# Altium schematic sheet 气象传感器.SchDoc
size A2; Organization: Altium Limited; Address1: L3, 12a Rodborough Rd; Address2: Frenchs Forest; Address3: NSW; Address4: Australia 2086
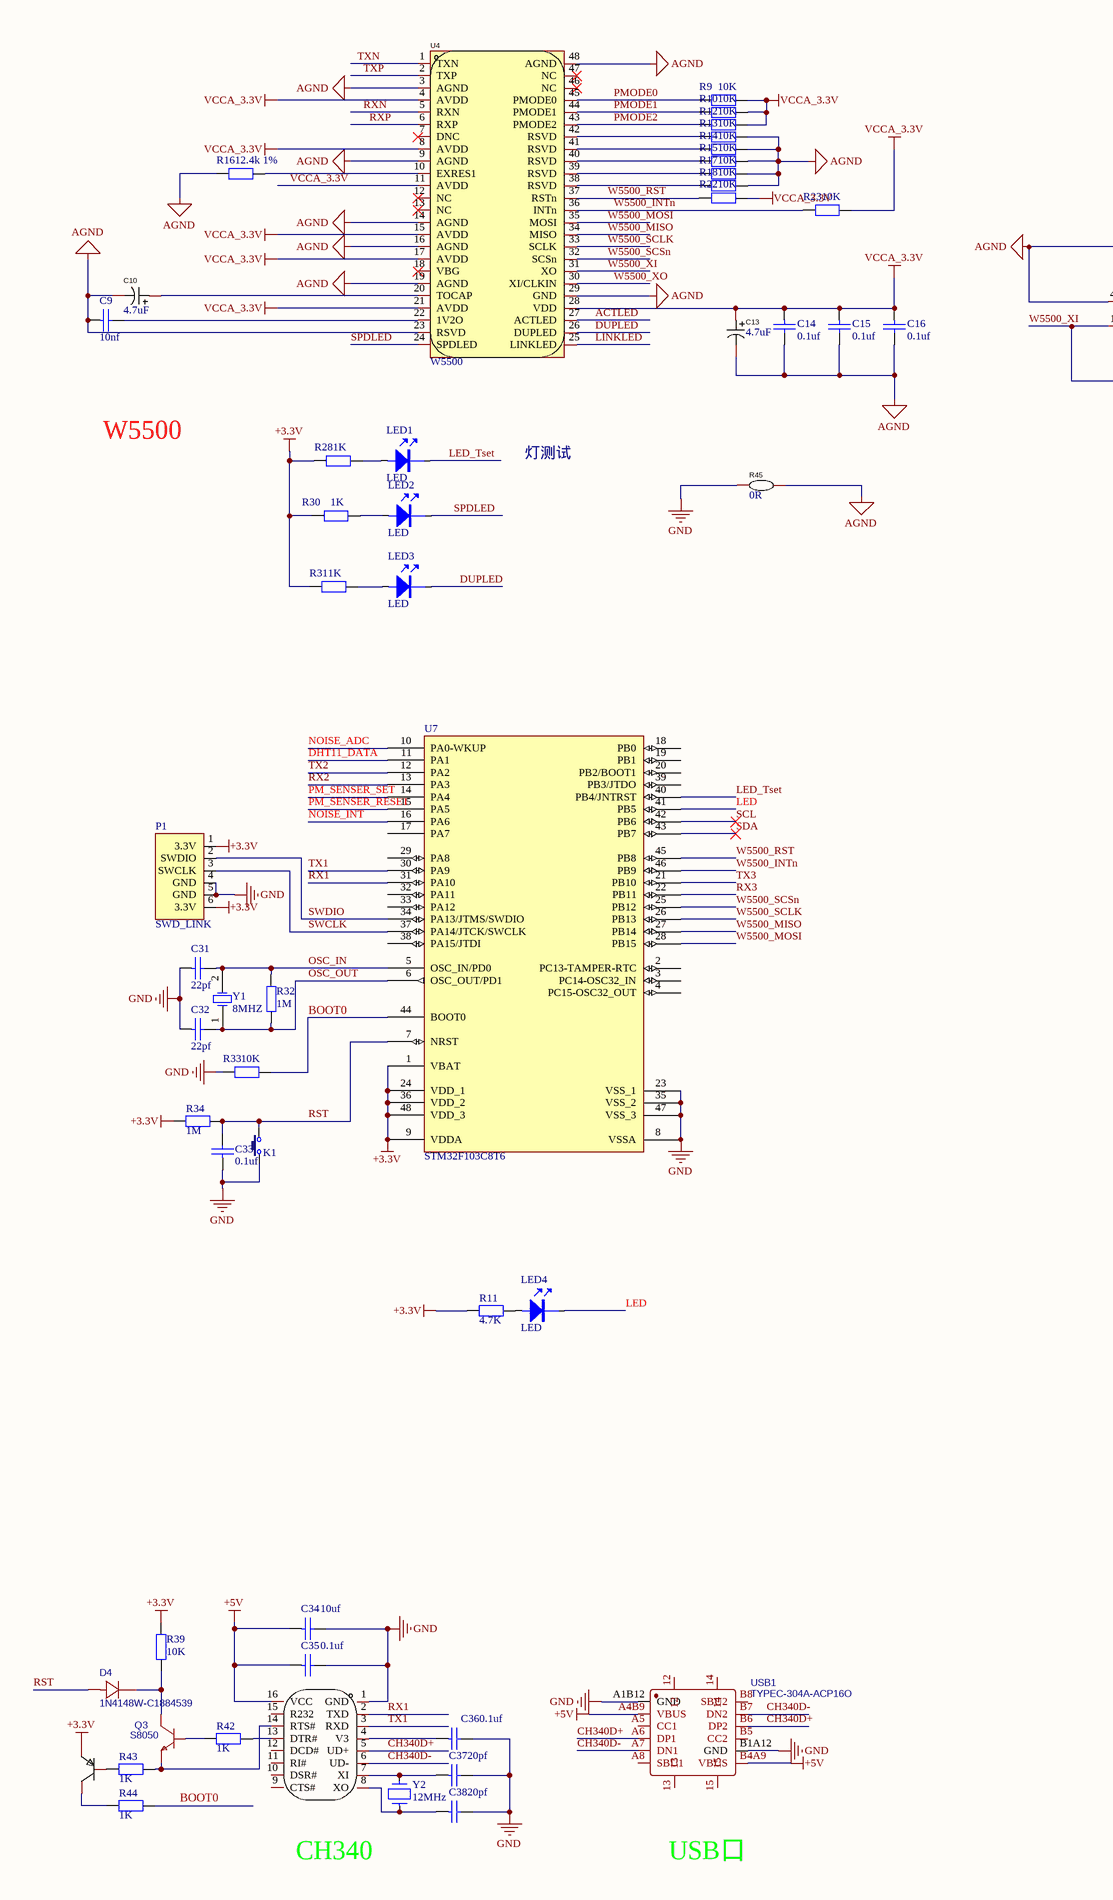
[diagram p0: 气象传感器.SchDoc, left]
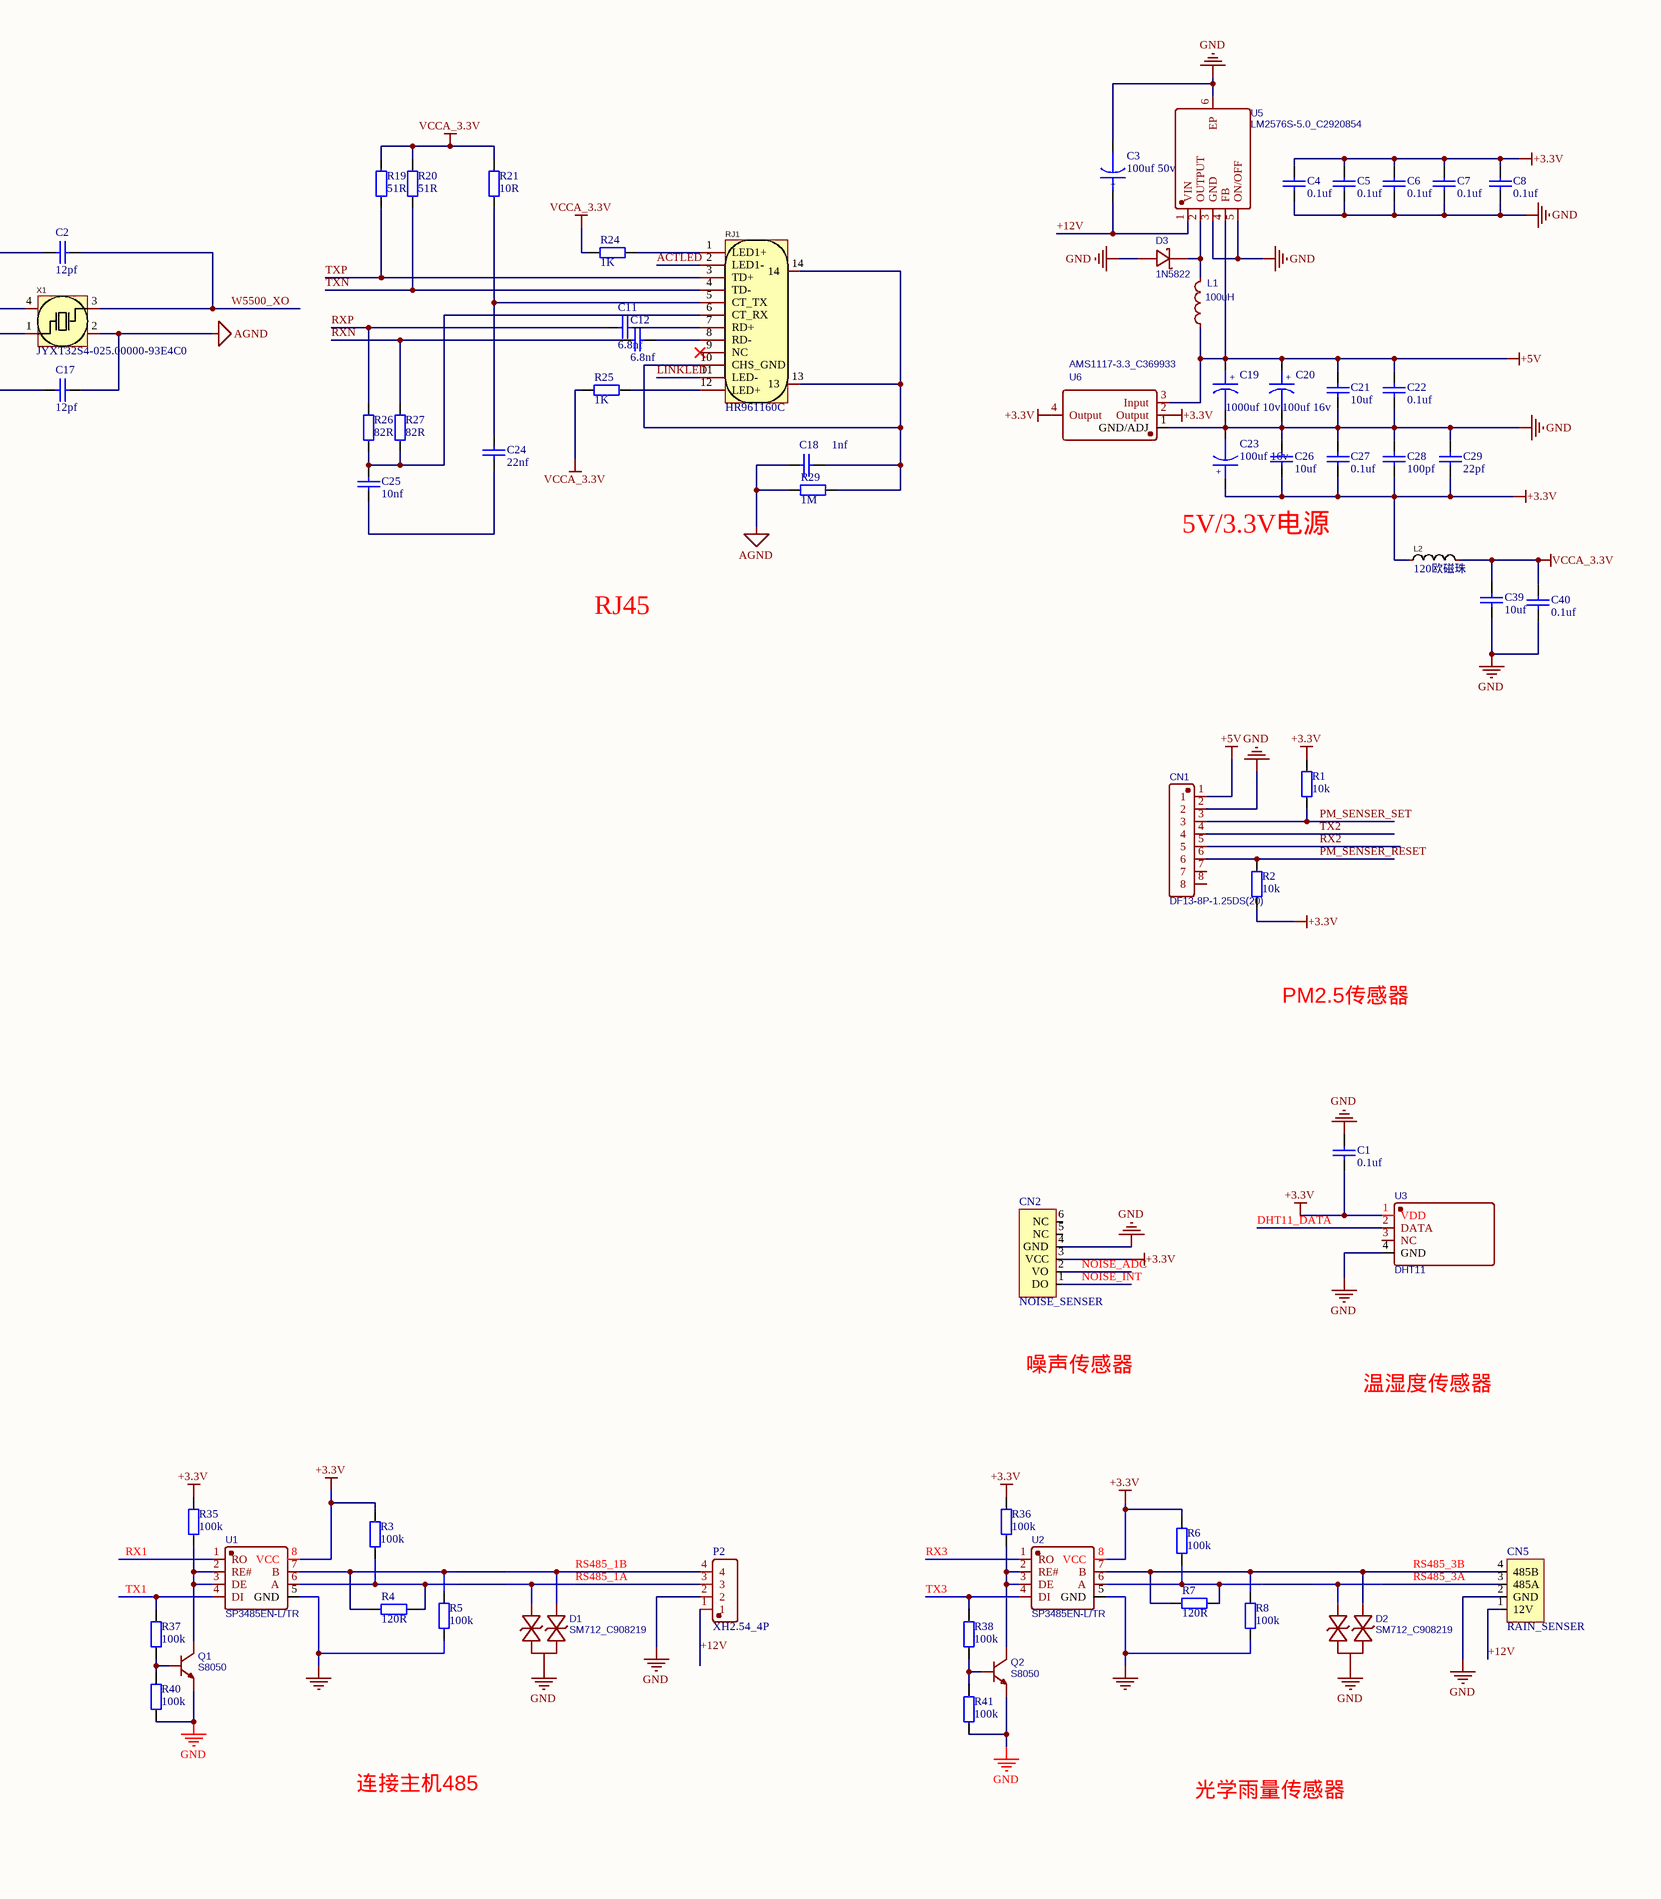
[diagram p1: 气象传感器.SchDoc, right]

## Parts
C1  value 0.1uf  [0603C]  (hidden comment: Capacitor)
C2  value 12pf  [0603C]  (hidden comment: Capacitor)
C3  value 100uf 50v  [CAP-TH_BD8.0-P3.50-D0.6-FD]  (hidden comment: Capacitor)
C4  value 0.1uf  [0603C]  (hidden comment: Capacitor)
C5  value 0.1uf  [0603C]  (hidden comment: Capacitor)
C6  value 0.1uf  [0603C]  (hidden comment: Capacitor)
C7  value 0.1uf  [0603C]  (hidden comment: Capacitor)
C8  value 0.1uf  [0603C]  (hidden comment: Capacitor)
C9  value 10nf  [0603C]  (hidden comment: Capacitor)
C10  4.7uF  [CAP-SMD_L1.6-W0.9-FD]
C11  value 6.8nf  [0603C]  (hidden comment: Capacitor)
C12  value 6.8nf  [0603C]  (hidden comment: Capacitor)
C13  4.7uF  [CAP-SMD_L1.6-W0.9-FD]
C14  value 0.1uf  [0603C]  (hidden comment: Capacitor)
C15  value 0.1uf  [0603C]  (hidden comment: Capacitor)
C16  value 0.1uf  [0603C]  (hidden comment: Capacitor)
C17  value 12pf  [0603C]  (hidden comment: Capacitor)
C18  value 1nf  [0603C]  (hidden comment: Capacitor)
C19  value 1000uf 10v  [CAP-TH_BD8.0-P3.50-D0.6-FD]  (hidden comment: Capacitor)
C20  value 100uf 16v  [CAP-TH_BD5.0-P2.00-D0.8-FD]  (hidden comment: Capacitor)
C21  value 10uf  [0805C]  (hidden comment: Capacitor)
C22  value 0.1uf  [0603C]  (hidden comment: Capacitor)
C23  value 100uf 16v  [CAP-TH_BD5.0-P2.00-D0.8-FD]  (hidden comment: Capacitor)
C24  value 22nf  [0603C]  (hidden comment: Capacitor)
C25  value 10nf  [0603C]  (hidden comment: Capacitor)
C26  value 10uf  [0805C]  (hidden comment: Capacitor)
C27  value 0.1uf  [0603C]  (hidden comment: Capacitor)
C28  value 100pf  [0603C]  (hidden comment: Capacitor)
C29  value 22pf  [0603C]  (hidden comment: Capacitor)
C31  value 22pf  [0603C]  (hidden comment: Capacitor)
C32  value 22pf  [0603C]  (hidden comment: Capacitor)
C33  value 0.1uf  [0603C]  (hidden comment: Capacitor)
C34  value 10uf  [0805C]  (hidden comment: Capacitor)
C35  value 0.1uf  [0603C]  (hidden comment: Capacitor)
C36  value 0.1uf  [0603C]  (hidden comment: Capacitor)
C37  value 20pf  [0603C]  (hidden comment: Capacitor)
C38  value 20pf  [0603C]  (hidden comment: Capacitor)
C39  value 10uf  [0805C]  (hidden comment: Capacitor)
C40  value 0.1uf  [0603C]  (hidden comment: Capacitor)
CN1  DF13-8P-1.25DS(20)  [CONN-TH_8P-P1.25_DF13-8P-1.25DS-20]
CN2  NOISE_SENSER  [NOISE_SENSER]
CN5  RAIN_SENSER  [RAIN_SENSER]
D1  SM712_C908219  [SOT-23-3_L2.9-W1.3-P1.90-LS2.4-BR]
D2  SM712_C908219  [SOT-23-3_L2.9-W1.3-P1.90-LS2.4-BR]
D3  1N5822  [SMA_L4.4-W2.8-LS5.4-RD]
D4  1N4148W-C1884539  [SOD-123_4148]
K1  3x6x5  [TSW SMD-3*6*2.5]  (value not drawn)
L1  100uH  [IND-TH_BD10.0-P5.00-D0.7]
L2  120欧磁珠  [L0603]
LED1  LED  [0603-LED]
LED2  LED  [0603-LED]
LED3  LED  [0603-LED]
LED4  LED  [0603-LED]
P1  SWD_LINK  [SWD_LINK]
P2  XH2.54_4P  [5.08 LINKER 1*4]
Q1  S8050  [SOT-23]
Q2  S8050  [SOT-23]
Q3  S8050  [SOT-23]
Q4  S8550  [SOT-23-3_L2.9-W1.3-P1.90-LS2.4-BR]  (value not drawn)
R1  value 10k  [0603R]  (hidden comment: Resistor)
R2  value 10k  [0603R]  (hidden comment: Resistor)
R3  value 100k  [0603R]  (hidden comment: Resistor)
R4  value 120R  [0603R]  (hidden comment: Resistor)
R5  value 100k  [0603R]  (hidden comment: Resistor)
R6  value 100k  [0603R]  (hidden comment: Resistor)
R7  value 120R  [0603R]  (hidden comment: Resistor)
R8  value 100k  [0603R]  (hidden comment: Resistor)
R9  value 10K  [0603R]  (hidden comment: Resistor)
R10  value 10K  [0603R]  (hidden comment: Resistor)
R11  value 4.7K  [0603R]  (hidden comment: Resistor)
R12  value 10K  [0603R]  (hidden comment: Resistor)
R13  value 10K  [0603R]  (hidden comment: Resistor)
R14  value 10K  [0603R]  (hidden comment: Resistor)
R15  value 10K  [0603R]  (hidden comment: Resistor)
R16  value 12.4k 1%  [0603R]  (hidden comment: Resistor)
R17  value 10K  [0603R]  (hidden comment: Resistor)
R18  value 10K  [0603R]  (hidden comment: Resistor)
R19  value 51R  [0603R]  (hidden comment: Resistor)
R20  value 51R  [0603R]  (hidden comment: Resistor)
R21  value 10R  [0603R]  (hidden comment: Resistor)
R22  value 10K  [0603R]  (hidden comment: Resistor)
R23  value 10K  [0603R]  (hidden comment: Resistor)
R24  value 1K  [0603R]  (hidden comment: Resistor)
R25  value 1K  [0603R]  (hidden comment: Resistor)
R26  value 82R  [0603R]  (hidden comment: Resistor)
R27  value 82R  [0603R]  (hidden comment: Resistor)
R28  value 1K  [0603R]  (hidden comment: Resistor)
R29  value 1M  [0603R]  (hidden comment: Resistor)
R30  value 1K  [0603R]  (hidden comment: Resistor)
R31  value 1K  [0603R]  (hidden comment: Resistor)
R32  value 1M  [0603R]  (hidden comment: Resistor)
R33  value 10K  [0603R]  (hidden comment: Resistor)
R34  value 1M  [0603R]  (hidden comment: Resistor)
R35  value 100k  [0603R]  (hidden comment: Resistor)
R36  value 100k  [0603R]  (hidden comment: Resistor)
R37  value 100k  [0603R]  (hidden comment: Resistor)
R38  value 100k  [0603R]  (hidden comment: Resistor)
R39  value 10K  [0603R]  (hidden comment: Resistor)
R40  value 100k  [0603R]  (hidden comment: Resistor)
R41  value 100k  [0603R]  (hidden comment: Resistor)
R42  value 1K  [0603R]  (hidden comment: Resistor)
R43  value 1K  [0603R]  (hidden comment: Resistor)
R44  value 1K  [0603R]  (hidden comment: Resistor)
R45  0R  [R0603]
RJ1  HR961160C  [RJ45-SMD_HR961160C]
U1  SP3485EN-L/TR  [SOIC-8_L5.0-W4.0-P1.27-LS6.0-BL]
U2  SP3485EN-L/TR  [SOIC-8_L5.0-W4.0-P1.27-LS6.0-BL]
U3  DHT11  [DHT11]
U4  W5500  [LQFP-48_L7.0-W7.0-P0.50-LS9.0-BL]
U5  LM2576S-5.0_C2920854  [TO-263-5_L10.2-W8.6-P1.70-LS14.4-TL]
U6  AMS1117-3.3_C369933  [SOT-223-4_L6.5-W3.5-P2.30-LS7.0-BR]
U7  STM32F103C8T6  [LQFP48 7X7_M]
U8  CH340G  [SOIC-16_L9.9-W3.9-P1.27-LS6.0-BL]  (value not drawn)
USB1  TYPEC-304A-ACP16O  [USB-SMD_TYPEC-304A-ACP16O]
X1  JYXT32S4-025.00000-93E4C0  [OSC-SMD_4P-L3.2-W2.5-BL]
Y1  8MHZ  [XTAL1]
Y2  12MHz  [XTAL1]

## Nets
+3.3V: C1.1 C4.1 C5.1 C6.1 C7.1 C8.1 C23.1 C26.2 C27.2 C28.2 C29.2 CN2.3(VCC) L2.1 P1.1(3.3V) P1.6(3.3V) Q4.2(E) R1.2 R2.1 R3.1 R6.2 R11.2 R28.2 R30.2 R31.2 R34.2 R35.1 R36.1 R39.1 U1.8(VCC) U2.8(VCC) U3.1(VDD) U6.2(Output) U6.4(Output) U7.1(VBAT) U7.9(VDDA) U7.24(VDD_1) U7.36(VDD_2) U7.48(VDD_3)
+5V: C19.1 C20.1 C21.1 C22.1 C34.1 C35.1 CN1.1 L1.1 U5.4(FB) U6.3(Input) U8.16(VCC) USB1.A4B9(VBUS) USB1.B4A9(VBUS)
AGND: C2.1 C9.1 C10.2 C13.2 C14.2 C15.2 C16.2 C17.2 C18.2 R13.1 R14.1 R15.1 R16.2 R17.1 R18.1 R29.1 R45.1 U4.3(AGND) U4.9(AGND) U4.14(AGND) U4.16(AGND) U4.19(AGND) U4.23(RSVD) U4.29(GND) U4.48(AGND) X1.2(GND) X1.4(GND)
GND: C1.2 C3.2 C4.2 C5.2 C6.2 C7.2 C8.2 C19.2 C20.2 C21.2 C22.2 C23.2 C26.1 C27.1 C28.1 C29.1 C31.1 C32.1 C33.1 C34.2 C35.2 C36.2 C37.2 C38.2 C39.2 C40.2 CN1.2 CN2.4(GND) CN5.2(GND) D1.3 D2.3 D3.2(A) K1.1 P1.4(GND) P1.5(GND) P2.2 Q1.2(E) Q2.2(E) R5.1 R8.1 R33.2 R40.2 R41.2 R45.2 U1.5(GND) U2.5(GND) U3.4(GND) U5.3(GND) U5.5(ON/OFF) U5.6(EP) U6.1(GND/ADJ) U7.8(VSSA) U7.23(VSS_1) U7.35(VSS_2) U7.47(VSS_3) U8.1(GND) USB1.A1B12(GND) USB1.B1A12(GND)
VCCA_3.3V: C13.1 C14.1 C15.1 C16.1 C39.1 C40.1 L2.2 R9.1 R10.1 R12.1 R19.1 R20.1 R21.1 R22.1 R23.1 R24.1 R25.1 U4.4(AVDD) U4.8(AVDD) U4.11(AVDD) U4.15(AVDD) U4.17(AVDD) U4.21(AVDD) U4.28(VDD)
+12V: C3.1 CN5.1(12V) P2.1 U5.1(VIN)
ACTLED: RJ1.2(LED1-) U4.27(ACTLED)
BOOT0: R33.1 R44.1 U7.44(BOOT0)
CH340D+: U8.5(UD+) USB1.A6(DP1) USB1.B6(DP2)
CH340D-: U8.6(UD-) USB1.A7(DN1) USB1.B7(DN2)
DHT11_DATA: U3.2(DATA) U7.11(PA1)
DUPLED: LED3.2 U4.26(DUPLED)
LED: LED4.2 U7.41(PB5)
LED_Tset: LED1.2 U7.40(PB4/JNTRST)
LINKLED: RJ1.11(LED-) U4.25(LINKLED)
NOISE_ADC: CN2.2(VO) U7.10(PA0-WKUP)
NOISE_INT: CN2.1(DO) U7.16(PA6)
OSC_IN: C31.2 R32.2 U7.5(OSC_IN/PD0) Y1.2(OSC2)
OSC_OUT: C32.2 R32.1 U7.6(OSC_OUT/PD1) Y1.1(OSC1)
PM_SENSER_RESET: CN1.6 R2.2 U7.15(PA5)
PM_SENSER_SET: CN1.3 R1.1 U7.14(PA4)
PMODE0: R9.2 U4.45(PMODE0)
PMODE1: R10.2 U4.44(PMODE1)
PMODE2: R12.2 U4.43(PMODE2)
RS485_1A: D1.2 P2.3 R3.2 R4.2 U1.6(A)
RS485_1B: D1.1 P2.4 R4.1 R5.2 U1.7(B)
RS485_3A: CN5.3(485A) D2.2 R6.1 R7.1 U2.6(A)
RS485_3B: CN5.4(485B) D2.1 R7.2 R8.2 U2.7(B)
RST: C33.2 D4.2 K1.2 R34.1 U7.7(NRST)
RX1: U1.1(RO) U7.31(PA10) U8.2(TXD)
RX2: CN1.5 U7.13(PA3)
RX3: U2.1(RO) U7.22(PB11)
RXN: C12.1 R27.1 U4.5(RXN)
RXP: C11.1 R26.1 U4.6(RXP)
SCL: U7.42(PB6)
SDA: U7.43(PB7)
SPDLED: LED2.2 U4.24(SPDLED)
SWCLK: P1.3(SWCLK) U7.37(PA14/JTCK/SWCLK)
SWDIO: P1.2(SWDIO) U7.34(PA13/JTMS/SWDIO)
TX1: R37.1 U1.4(DI) U7.30(PA9) U8.3(RXD)
TX2: CN1.4 U7.12(PA2)
TX3: R38.1 U2.4(DI) U7.21(PB10)
TXN: R20.2 RJ1.4(TD-) U4.1(TXN)
TXP: R19.2 RJ1.3(TD+) U4.2(TXP)
W5500_INTn: R23.2 U4.36(INTn) U7.46(PB9)
W5500_MISO: U4.34(MISO) U7.27(PB14)
W5500_MOSI: U4.35(MOSI) U7.28(PB15)
W5500_RST: R22.2 U4.37(RSTn) U7.45(PB8)
W5500_SCLK: U4.33(SCLK) U7.26(PB13)
W5500_SCSn: U4.32(SCSn) U7.25(PB12)
W5500_XI: C17.1 U4.31(XO) X1.1(OSC1)
W5500_XO: C2.2 U4.30(XI/CLKIN) X1.3(OSC2)
NetC9_2: C9.2 U4.22(1V2O)
NetC10_1: C10.1 U4.20(TOCAP)
NetC11_2: C11.2 RJ1.7(RD+)
NetC12_2: C12.2 RJ1.8(RD-)
NetC18_1: C18.1 R29.2 RJ1.10(CHS_GND) RJ1.13 RJ1.14
NetC24_1: C24.1 C25.1
NetC24_2: C24.2 R21.2 RJ1.5(CT_TX)
NetC25_2: C25.2 R26.2 R27.2 RJ1.6(CT_RX)
NetC36_1: C36.1 U8.4(V3)
NetC37_1: C37.1 U8.7(XI) Y2.2
NetC38_1: C38.1 U8.8(XO) Y2.1
NetD3_1: D3.1(C) L1.2 U5.2(OUTPUT)
NetD4_1: D4.1 Q3.3(C) R39.2
NetLED1_1: LED1.1 R28.1
NetLED2_1: LED2.1 R30.1
NetLED3_1: LED3.1 R31.1
NetLED4_1: LED4.1 R11.1
NetQ1_1: Q1.1(B) R37.2 R40.1
NetQ1_3: Q1.3(C) R35.2 U1.2(RE#) U1.3(DE)
NetQ2_1: Q2.1(B) R38.2 R41.1
NetQ2_3: Q2.3(C) R36.2 U2.2(RE#) U2.3(DE)
NetQ3_1: Q3.1(B) R42.2
NetQ3_2: Q3.2(E) R43.1 U8.14(RTS#)
NetQ4_1: Q4.1(B) R43.2
NetQ4_3: Q4.3(C) R44.2
NetR13_2: R13.2 U4.42(RSVD)
NetR14_2: R14.2 U4.41(RSVD)
NetR15_2: R15.2 U4.40(RSVD)
NetR16_1: R16.1 U4.10(EXRES1)
NetR17_2: R17.2 U4.39(RSVD)
NetR18_2: R18.2 U4.38(RSVD)
NetR24_2: R24.2 RJ1.1(LED1+)
NetR25_2: R25.2 RJ1.12(LED+)
NetR42_1: R42.1 U8.13(DTR#)

Not connected (* = marked no-connect by the designer): CN1 7 8; CN2 5(NC) 6(NC); RJ1 9(NC)*; U3 3(NC); U4 7(DNC)* 12(NC)* 13(NC)* 18(VBG)* 46(NC)* 47(NC)*; U7 2(PC13-TAMPER-RTC) 3(PC14-OSC32_IN) 4(PC15-OSC32_OUT) 17(PA7) 18(PB0) 19(PB1) 20(PB2/BOOT1) 29(PA8) 32(PA11) 33(PA12) 38(PA15/JTDI) 39(PB3/JTDO); U8 9(CTS#) 10(DSR#) 11(RI#) 12(DCD#) 15(R232); USB1 12 13 14 15 A5(CC1) A8(SBU1) B5(CC2) B8(SBU2)

## Notes on the sheet
- W5500
- 灯测试
- 5V/3.3V电源
- RJ45
- PM2.5传感器
- 噪声传感器
- 温湿度传感器
- 连接主机485
- 光学雨量传感器
- CH340
- USB口
- Title
- Size:
- Date:
- File:
- A2
- Number:
- Time:
- Revision:
- Sheet
- of
- (in symbol CAP+) +

## Library data of the parts
C1 C2 C4-C9 C11 C12 C14-C18 C21 C22 C24-C29 C31-C40 = CAP
C3 C19 C20 C23 = CAP+
C10 C13 = F980J106MMA: 钽电容; Manufacturer: Kyocera AVX; Add into BOM: yes; Name: F980J106MMA; Symbol: F980J106MMA; Device: F980J106MMA; LCSC Part Name: 钽电容; Supplier Part: C4153836; Manufacturer Part: F980J106MMA; Supplier Footprint: 0603; JLCPCB Part Class: Extended Part; Datasheet: https://atta.szlcsc.com/upload/public/pdf/source/20211207/218718C9D5A7FAAA07FA57F61A08BACF.pdf; Supplier: LCSC; Convert to PCB: yes
CN1 = DF13-8P-1.25DS(20): BOM_Manufacturer: HRS(Hirose); Contributor: LCSC; BOM_Supplier: LCSC; BOM_Supplier Part: C597874; BOM_Manufacturer Part: DF13-8P-1.25DS(20); BOM_JLCPCB Part Class: Extended Part; spicePre: C; spiceSymbolName: DF13-8P-1.25DS(20)
CN5 = RAIN_SENSER: 雨量传感器接口
D1 D2 = SM712_C908219: BOM_Manufacturer: FUXINSEMI; BOM_Manufacturer Part: SM712; Contributor: LCSC; BOM_Supplier: LCSC; BOM_Supplier Part: C908219; BOM_JLCPCB Part Class: Extended Part; spicePre: D; spiceSymbolName: SM712_C908219
D3 = 1N5822: BOM_Manufacturer: KEXIN; BOM_Manufacturer Part: 1N5819; Contributor: LCSC; BOM_Supplier: LCSC; BOM_Supplier Part: C437199; BOM_JLCPCB Part Class: Extended Part; spicePre: D; spiceSymbolName: 1N5819_C437199
D4 = 1N4148W-C1884539: BOM_Manufacturer: YFW佑风微; Contributor: LCSC; BOM_Supplier: LCSC; BOM_Supplier Part: C1884539; BOM_Manufacturer Part: 1N4148W; BOM_JLCPCB Part Class: Extended Part; spicePre: D; spiceSymbolName: 1N4148W-C1884539
K1 = TSW 3x6: 3x6轻触开关; 版权归属: 源创客; BOM名称: 3x6轻触开关; 学习资源: www.ooocke.com
L1 = L: Inductance; BOM_Manufacturer: FH; BOM_Manufacturer Part: VLU0810-101K; BOM_Supplier: LCSC; nameAlias: Inductance; BOM_Supplier Part: C72630; BOM_JLCPCB Part Class: Extended Part; spicePre: L; spiceSymbolName: VLU0810-101K
L2 = GZ1608D121TF: 磁珠; Manufacturer: Sunlord(顺络); Symbol: GZ1608D121TF-C12391; Add into BOM: yes; Impedance @ Frequency: 120Ω@100MHz; Tolerance: ±25%; DC Resistance: 200mΩ; Current Rating: 300mA; Circuits: 1; Name: GZ1608D121TF; Device: GZ1608D121TF; LCSC Part Name: 120Ω@100MHz ±25%; Supplier Part: C12391; Manufacturer Part: GZ1608D121TF; Supplier Footprint: 0603; JLCPCB Part Class: Extended Part; Datasheet: https://atta.szlcsc.com/upload/public/pdf/source/20210830/355EA7C0FAC5394FC0FE3F17C770C20A.pdf; Supplier: LCSC; Convert to PCB: yes
Q1-Q3 = S8050: BOM_Manufacturer: BORN伯恩半导体; Contributor: mengruisheng; BOM_Supplier Part: C266592; BOM_Supplier: LCSC; spicePre: Q; spiceSymbolName: NPN; BOM_Manufacturer Part: S8050
Q4 = S8550: Manufacturer: UMW(友台半导体); Symbol: S8550_C545533; Add into BOM: yes; Transistor Type: PNP; Collector-Emitter Breakdown Voltage (Vceo): 25V; Collector Current (Ic): 500mA; Power Dissipation (Pd): 300mW; Collector-Emitter Saturation Voltage (VCE(sat)@Ic,Ib): 600mV@500mA,50mA; Transition Frequency (fT): 150MHz; Name: S8550; Device: S8550; LCSC Part Name: S8550; Supplier Part: C545533; Manufacturer Part: S8550; Supplier Footprint: SOT-23-3; JLCPCB Part Class: Extended Part; Datasheet: https://atta.szlcsc.com/upload/public/pdf/source/20211011/8CBA04D874BE5A0FC10F979D18183A3A.pdf; Supplier: LCSC; Convert to PCB: yes; DC Current Gain (hFE@Ic,Vce): -; Operating Temperature: +150℃@(Tj)
R1-R44 = RES: Resistor SMD - IEC symbol version; LatestRevisionDate: 27-Jul-20  -  Semtech
R45 = TC0325B330JT5E: 电阻; Manufacturer: UNI-ROYAL(厚声); Name: 33Ω; Add into BOM: yes; Value: 33Ω; Tolerance: ±0.1%; Power(Watts): 166.667mW; Temperature Coefficient: ±25ppm/℃; Overload Voltage (Max): 75V; Symbol: TC0325B330JT5E; Device: TC0325B330JT5E; LCSC Part Name: 33Ω ±0.1% 166.667mW; Supplier Part: C61958; Manufacturer Part: TC0325B330JT5E; Supplier Footprint: 0603; JLCPCB Part Class: Extended Part; Datasheet: https://atta.szlcsc.com/upload/public/pdf/source/20190404/C61958_CC7C54455B4CAE3BAEFDAC24C5E38D4A.pdf; Supplier: LCSC; Convert to PCB: yes; Operating Temperature Range: -55℃~+155℃
RJ1 = HR961160C: RJ45; Manufacturer: HANRUN(汉仁); Add into BOM: yes; Connector Type: RJ插座; Number of Ports: 1; LED: 有; Name: HR961160C; Symbol: HR961160C; Device: HR961160C; LCSC Part Name: RJ45 1*1 带灯; Supplier Part: C55683; Manufacturer Part: HR961160C; Supplier Footprint: 插件; JLCPCB Part Class: Extended Part; Datasheet: https://atta.szlcsc.com/upload/public/pdf/source/20151014/1457707458793.pdf; Supplier: LCSC; Convert to PCB: yes; USOC Codes: RJ45; Ratings: -; Shielding: -
U1 U2 = SP3485EN-L/TR: BOM_Manufacturer: EXAR; BOM_Supplier: LCSC; BOM_Manufacturer Part: SP3485EN-L/TR; BOM_Supplier Part: C8963; BOM_JLCPCB Part Class: Basic Part; spicePre: U; spiceSymbolName: SP3485EN-L/TR
U3 = DHT11: BOM_Manufacturer: Aosong (Guangzhou) Elec; Contributor: LCSC; BOM_Supplier: LCSC; BOM_Supplier Part: C117051; BOM_Manufacturer Part: DHT11; BOM_JLCPCB Part Class: Extended Part; spicePre: U; spiceSymbolName: DHT11
U4 = W5500: 以太网控制芯片; Manufacturer: WIZNET; Add into BOM: yes; Standards: 10/100 Base-T/TX PHY; Interface: SPI; Supply Voltage: 2.97V ~ 3.63V; Supply Current: 132mA; Name: W5500; Symbol: W5500; Device: W5500; LCSC Part Name: W5500; Supplier Part: C32843; Manufacturer Part: W5500; Supplier Footprint: LQFP-48_7x7x05P; JLCPCB Part Class: Extended Part; Datasheet: https://atta.szlcsc.com/upload/public/pdf/source/20140704/1457707126739.pdf; Supplier: LCSC; Convert to PCB: yes; Type: Ethernet Controllers; Number of Channels: -
U5 = LM2576S-5.0_C2920854: LM2576S-5.0; BOM_Manufacturer: minos(迈诺斯); Contributor: LCSC; BOM_Supplier: LCSC; BOM_Supplier Part: C2920854; BOM_Manufacturer Part: LM2576S-5.0; BOM_JLCPCB Part Class: Extended Part; spicePre: U; spiceSymbolName: LM2576S-5.0_C2920854
U6 = AMS1117-3.3_C369933: AMS1117-3.3; BOM_Manufacturer: KEXIN; Contributor: LCSC; BOM_Supplier: LCSC; BOM_Supplier Part: C369933; BOM_Manufacturer Part: AMS1117-3.3; BOM_JLCPCB Part Class: Extended Part; spicePre: U; spiceSymbolName: AMS1117-3.3_C369933
U7 = STM32F103C8T6: Flaah:64/RAM:20/IO:36; BOM名称: 32位STM单片机; 版权归属: 源创客; 学习资源: www.ooocke.com
U8 = CH340G: Manufacturer: WCH(南京沁恒); Add into BOM: yes; Protocol: USB 2.0; Data Rate: 2Mbps; Supply Voltage: 3.3V, 5V; Name: CH340G; Symbol: CH340G; Device: CH340G; LCSC Part Name: CH340G; Supplier Part: C14267; Manufacturer Part: CH340G; Supplier Footprint: SOP-16_150mil; JLCPCB Part Class: Extended Part; Datasheet: https://atta.szlcsc.com/upload/public/pdf/source/20200819/C14267_9F0B4B8160AEBA86F3219E64956E4601.pdf; Supplier: LCSC; Convert to PCB: yes; Type: Transceiver; Number of Drivers/Receivers: -
USB1 = TYPEC-304A-ACP16O: BOM_Manufacturer: XUNPU(讯普); Contributor: LCSC; BOM_Supplier: LCSC; BOM_Supplier Part: C2909610; BOM_Manufacturer Part: TYPEC-304A-ACP16O; BOM_JLCPCB Part Class: Extended Part; spicePre: U; spiceSymbolName: TYPEC-304A-ACP16O
X1 = JYXT32S4-025.00000-93E4C0: 25Mhz晶振; Manufacturer: JINGYOU(晶优); Add into BOM: yes; Name: -; Symbol: JYXT32S4-025.00000-93E4C0; Device: JYXT32S4-025.00000-93E4C0; LCSC Part Name: 25MHz 12pF; Supplier Part: C394378; Manufacturer Part: JYXT32S4-025.00000-93E4C0; Supplier Footprint: SMD3225-4P; JLCPCB Part Class: Extended Part; Datasheet: https://atta.szlcsc.com/upload/public/pdf/source/20190902/C394378_A3BD37707606032D901F464AD0418325.pdf; Supplier: LCSC; Convert to PCB: yes; Crystal Type: -; Value: -; Frequency Tolerance: -; Frequency Stability: -; Load Capacitance: -; Operating Temperature: -
Y1 Y2 = XTAL: Crystal Oscillator
  Y1: Published: 8-Jun-2000; LatestRevisionDate: 17-Jul-2002; LatestRevisionNote: Re-released for DXP Platform.; PackageReference: R38; Publisher: Altium Limited; PackageDescription: Crystal, Thru-Hole; 2 Leads; Body 3.1 x 8.2 mm (Dia.xH)